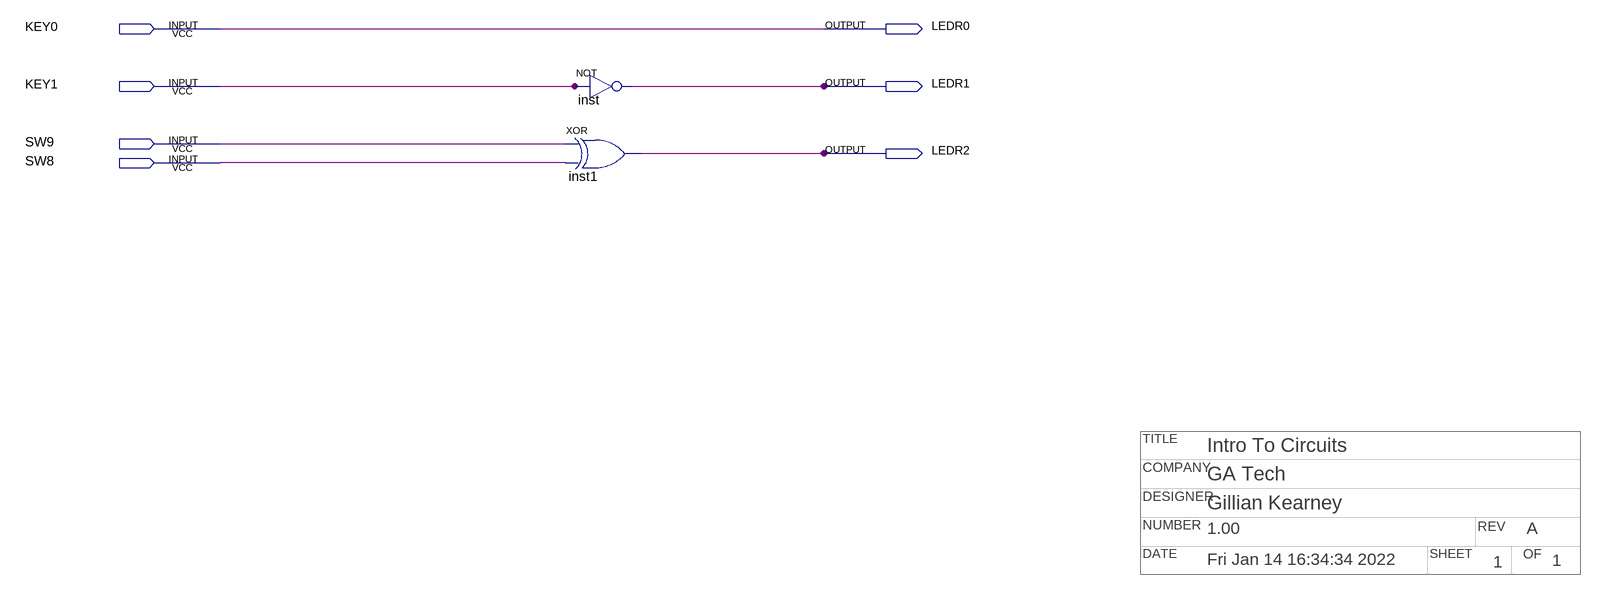
[diagram p0: schematic sheet]
// Quartus schematic IntroToCircuits.bdf as structural Verilog: 2 symbols, 7 pins
// Title block: COMPANY: GA Tech; DATE: Fri Jan 14 16:34:34 2022; DESIGNER: Gillian Kearney; NUMBER: 1.00; OF: 1; REV: A; SHEET: 1; TITLE: Intro To Circuits
module IntroToCircuits (
  input  KEY0,
  input  KEY1,
  input  SW9,
  input  SW8,
  output LEDR0,
  output LEDR1,
  output LEDR2
);

  not inst (LEDR1, KEY1);
  xor inst1 (LEDR2, SW9, SW8);

  assign LEDR0 = KEY0;
endmodule
